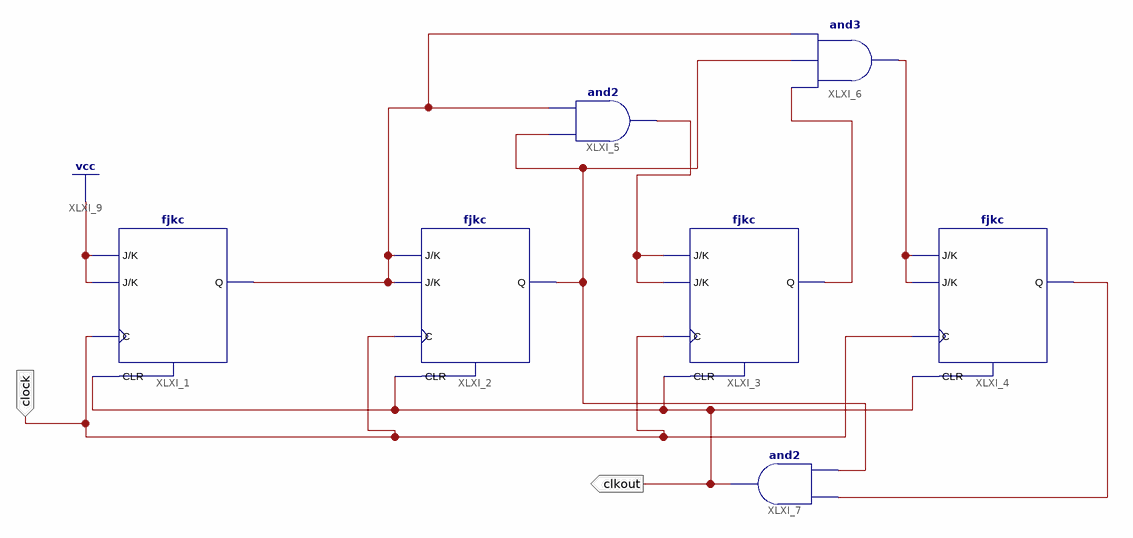
[diagram p0: schematic sheet 1]
// Xilinx ISE schematic mod10.sch (spartan6) as structural Verilog: 7 symbols, 2 ports
module mod10 (
  input  clock,
  output clkout
);

  wire XLXN_2, XLXN_3, XLXN_6, XLXN_7, XLXN_8, XLXN_10;

  fjkc XLXI_1 (.C(clock), .CLR(clkout), .J(1'b1), .K(1'b1), .Q(XLXN_6));
  fjkc XLXI_2 (.C(clock), .CLR(clkout), .J(XLXN_6), .K(XLXN_6), .Q(XLXN_8));
  fjkc XLXI_3 (.C(clock), .CLR(clkout), .J(XLXN_2), .K(XLXN_2), .Q(XLXN_3));
  fjkc XLXI_4 (.C(clock), .CLR(clkout), .J(XLXN_7), .K(XLXN_7), .Q(XLXN_10));
  and XLXI_5 (XLXN_2, XLXN_8, XLXN_6);
  and XLXI_6 (XLXN_7, XLXN_3, XLXN_8, XLXN_6);
  and XLXI_7 (clkout, XLXN_8, XLXN_10);
endmodule
